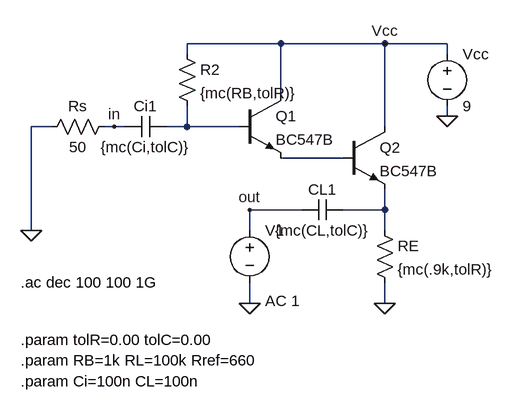
[diagram p0: schematic PL_Rout.asc]
PL_Rout.asc, the LTspice schematic file:
Version 4
SHEET 1 1240 680
WIRE 176 32 32 32
WIRE 336 32 176 32
WIRE 432 32 336 32
WIRE 32 48 32 32
WIRE 432 48 432 32
WIRE 176 112 176 32
WIRE 432 144 432 128
WIRE -176 160 -208 160
WIRE -80 160 -96 160
WIRE -64 160 -80 160
WIRE 32 160 32 128
WIRE 32 160 0 160
WIRE 112 160 32 160
WIRE 336 160 336 32
WIRE 272 208 176 208
WIRE 208 288 128 288
WIRE 336 288 336 256
WIRE 336 288 272 288
WIRE -208 320 -208 160
WIRE 128 320 128 288
WIRE 336 320 336 288
WIRE 128 432 128 400
WIRE 336 432 336 400
FLAG 432 144 0
FLAG 336 432 0
FLAG 336 32 Vcc
FLAG 128 432 0
FLAG -208 320 0
FLAG -80 160 in
FLAG 128 288 out
SYMBOL npn 112 112 R0
SYMATTR InstName Q1
SYMATTR Value BC547B
SYMBOL npn 272 160 R0
SYMATTR InstName Q2
SYMATTR Value BC547B
SYMBOL voltage 432 32 R0
WINDOW 123 0 0 Left 0
WINDOW 39 0 0 Left 0
SYMATTR InstName Vcc
SYMATTR Value 9
SYMBOL res 320 304 R0
SYMATTR InstName RE
SYMATTR Value {mc(.9k,tolR)}
SYMBOL res 16 32 R0
SYMATTR InstName R2
SYMATTR Value {mc(RB,tolR)}
SYMBOL cap 0 144 R90
WINDOW 0 0 32 VBottom 2
WINDOW 3 32 32 VTop 2
SYMATTR InstName Ci1
SYMATTR Value {mc(Ci,tolC)}
SYMBOL res -80 144 R90
WINDOW 0 0 56 VBottom 2
WINDOW 3 32 56 VTop 2
SYMATTR InstName Rs
SYMATTR Value 50
SYMBOL cap 272 272 R90
WINDOW 0 0 32 VBottom 2
WINDOW 3 32 32 VTop 2
SYMATTR InstName CL1
SYMATTR Value {mc(CL,tolC)}
SYMBOL voltage 128 304 R0
WINDOW 123 24 124 Left 2
WINDOW 39 0 0 Left 0
SYMATTR InstName V1
SYMATTR Value ""
SYMATTR Value2 AC 1
TEXT -224 400 Left 2 !.ac dec 100 100 1G
TEXT -224 488 Left 2 !.param tolR=0.00 tolC=0.00
TEXT -224 520 Left 2 !.param RB=1k RL=100k Rref=660
TEXT -224 552 Left 2 !.param Ci=100n CL=100n

The netlist it stands for:
* PL_Rout.asc
Q1 Vcc N001 N002 0 BC547B
Q2 Vcc N002 N003 0 BC547B
Vcc Vcc 0 9
RE N003 0 {mc(.9k,tolR)}
R2 Vcc N001 {mc(RB,tolR)}
Ci1 N001 in {mc(Ci,tolC)}
Rs in 0 50
CL1 N003 out {mc(CL,tolC)}
V1 out 0 AC 1
.model NPN NPN
.model PNP PNP
.lib standard.bjt
.ac dec 100 100 1G
.param tolR=0.00 tolC=0.00
.param RB=1k RL=100k Rref=660
.param Ci=100n CL=100n
.backanno
.end